# Altium schematic sheet Radio.SchDoc
size A4
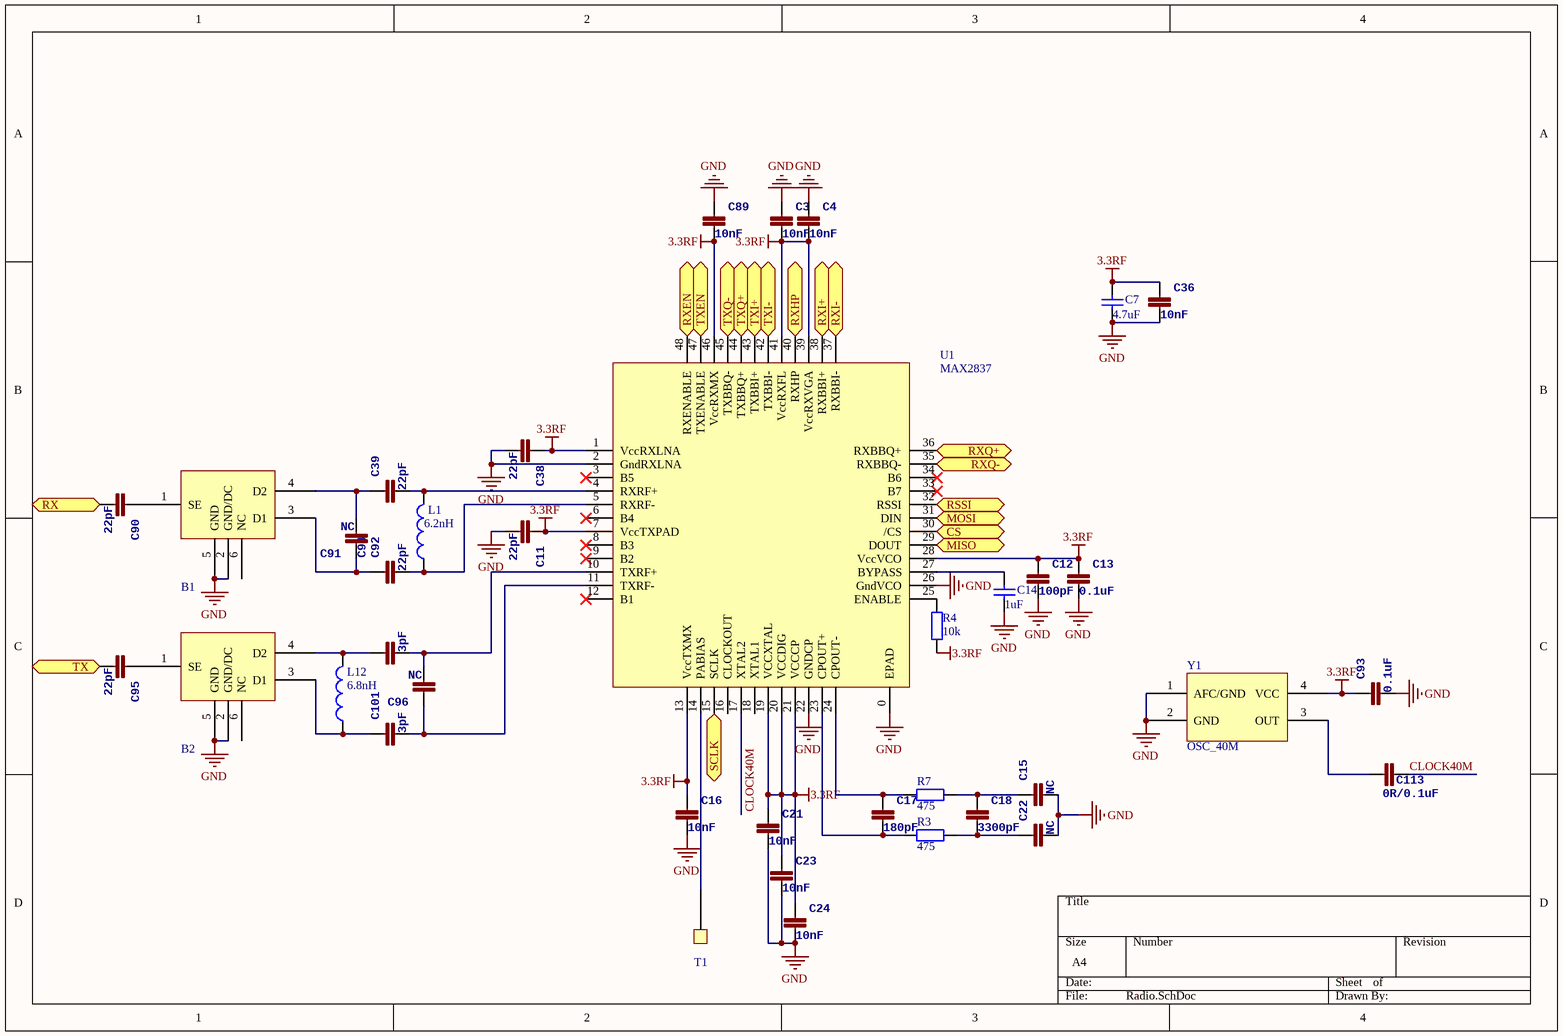
[diagram p0: Radio.SchDoc]

## Parts
B1  Balun  [HHM1711D1/HHM1732B1]  (value not drawn)
B2  Balun  [HHM1711D1/HHM1732B1]  (value not drawn)
C3  10nF  [0402]
C4  10nF  [0402]
C7  4.7uF  [0603]
C11  22pF  [0402]
C12  100pF  [0402]
C13  0.1uF  [0402]
C14  1uF  [0603]
C15  NC  [0402]
C16  10nF  [0402]
C17  180pF  [0402]
C18  3300pF  [0402]
C21  10nF  [0402]
C22  NC  [0402]
C23  10nF  [0402]
C24  10nF  [0402]
C36  10nF  [0402]
C38  22pF  [0402]
C39  22pF  [0402]
C89  10nF  [0402]
C90  22pF  [0402]
C91  NC  [0402]
C92  22pF  [0402]
C93  0.1uF  [0402]
C94  3pF  [0402]
C95  22pF  [0402]
C96  NC  [0402]
C101  3pF  [0402]
C113  0R/0.1uF  [0402]
L1  6.2nH  [0402]
L12  value 6.8nH  [0402]  (hidden comment: NC)
R3  475  [0402]
R4  10k  [0402]
R7  475  [0402]
T1  PABIAS  [TestPad - 1mm]  (value not drawn)
U1  MAX2837  [MAX2837]
Y1  OSC_40M  [TXC_7Q]

## Ports
CS, MISO, MOSI, RSSI, RX, RXEN, RXHP, RXI+, RXI-, RXQ+, RXQ-, SCLK, TX, TXEN, TXI+, TXI-, TXQ+, TXQ-

## Nets
3.3RF: C3.2 C4.2 C7.2 C11.1 C12.1 C13.1 C16.1 C21.1 C23.1 C24.1 C36.1 C38.1 C89.2 C93.1 R4.1 U1.1(VccRXLNA) U1.7(VccTXPAD) U1.13(VccTXMX) U1.19(VCCXTAL) U1.20(VCCDIG) U1.21(VCCCP) U1.28(VccVCO) U1.39(VccRXVGA) U1.41(VccRXFL) U1.46(VccRXMX) Y1.4(VCC)
GND: B1.2(GND/DC) B1.5(GND) B2.2(GND/DC) B2.5(GND) C3.1 C4.1 C7.1 C11.2 C12.2 C13.2 C14.1 C15.2 C16.2 C21.2 C22.2 C23.2 C24.2 C36.2 C38.2 C89.1 C93.2 U1.0(EPAD) U1.2(GndRXLNA) U1.22(GNDCP) U1.26(GndVCO) Y1.1(AFC/GND) Y1.2(GND)
CLOCK40M: C113.2 U1.17(XTAL2)
CS: U1.30(/CS) ; port CS
MISO: U1.29(DOUT) ; port MISO
MOSI: U1.31(DIN) ; port MOSI
RSSI: U1.32(RSSI) ; port RSSI
RX: C90.2 ; port RX
RXEN: U1.48(RXENABLE) ; port RXEN
RXHP: U1.40(RXHP) ; port RXHP
RXI+: U1.38(RXBBI+) ; port RXI+
RXI-: U1.37(RXBBI-) ; port RXI-
RXQ+: U1.36(RXBBQ+) ; port RXQ+
RXQ-: U1.35(RXBBQ-) ; port RXQ-
SCLK: U1.15(SCLK) ; port SCLK
TX: C95.2 ; port TX
TXEN: U1.47(TXENABLE) ; port TXEN
TXI+: U1.43(TXBBI+) ; port TXI+
TXI-: U1.42(TXBBI-) ; port TXI-
TXQ+: U1.44(TXBBQ+) ; port TXQ+
TXQ-: U1.45(TXBBQ-) ; port TXQ-
NetB1_1: B1.1(SE) C90.1
NetB1_3: B1.3(D1) C91.1 C92.1
NetB1_4: B1.4(D2) C39.1 C91.2
NetB2_1: B2.1(SE) C95.1
NetB2_3: B2.3(D1) C101.1 L12.1
NetB2_4: B2.4(D2) C94.1 L12.2
NetC14_2: C14.2 U1.27(BYPASS)
NetC15_1: C15.1 C18.1 R7.1
NetC17_1: C17.1 R7.2 U1.24(CPOUT-)
NetC17_2: C17.2 R3.2 U1.23(CPOUT+)
NetC18_2: C18.2 C22.1 R3.1
NetC39_2: C39.2 L1.2 U1.4(RXRF+)
NetC92_2: C92.2 L1.1 U1.5(RXRF-)
NetC94_2: C94.2 C96.2 U1.10(TXRF+)
NetC96_1: C96.1 C101.2 U1.11(TXRF-)
NetC113_1: C113.1 Y1.3(OUT)
NetR4_2: R4.2 U1.25(ENABLE)
NetT1_1: T1.1 U1.14(PABIAS)

Not connected (* = marked no-connect by the designer): B1 6(NC); B2 6(NC); U1 3(B5)* 6(B4)* 8(B3)* 9(B2)* 12(B1)* 16(CLOCKOUT) 18(XTAL1) 33(B7)* 34(B6)*

## Library data of the parts
C3 C4 C11-C13 C15-C18 C21-C24 C36 C38 C39 C89-C96 C101 C113 = CAP0402-CAP: <b>Capacitor</b> / Standard 0603 ceramic capacitor, and 0.1" leaded capacitor.; PARTNO: CC0402ZRY5V7BB104
C7 C14 = Cap: Capacitor; Published: 8-Jun-2000; LatestRevisionDate: 17-Jul-2002; LatestRevisionNote: Re-released for DXP Platform.; PackageReference: RAD-0.3; Publisher: Altium Limited; PackageDescription: Radial Cap, Thru-Hole; 2 Leads; 0.3 in Pin Spacing
L1 L12 = Inductor: Code_IEC: 1005; Published: 8-Jun-2000; LatestRevisionDate: 29-May-2009; LatestRevisionNote: IPC-7351 Footprint Added.; PackageReference: 0402-A; Publisher: Altium Limited; PackageDescription: Chip Inductor; Code_JEITA: 0402
R3 R4 R7 = Res2: Resistor; Published: 8-Jun-2000; LatestRevisionDate: 17-Jul-2002; LatestRevisionNote: Re-released for DXP Platform.; PackageReference: AXIAL-0.4; Publisher: Altium Limited; PackageDescription: Axial Device, Thru-Hole; 2 Leads; 0.4 in Pin Spacing
T1 = TestPad